# Altium project 0020-03_FFT2G.PrjPcb
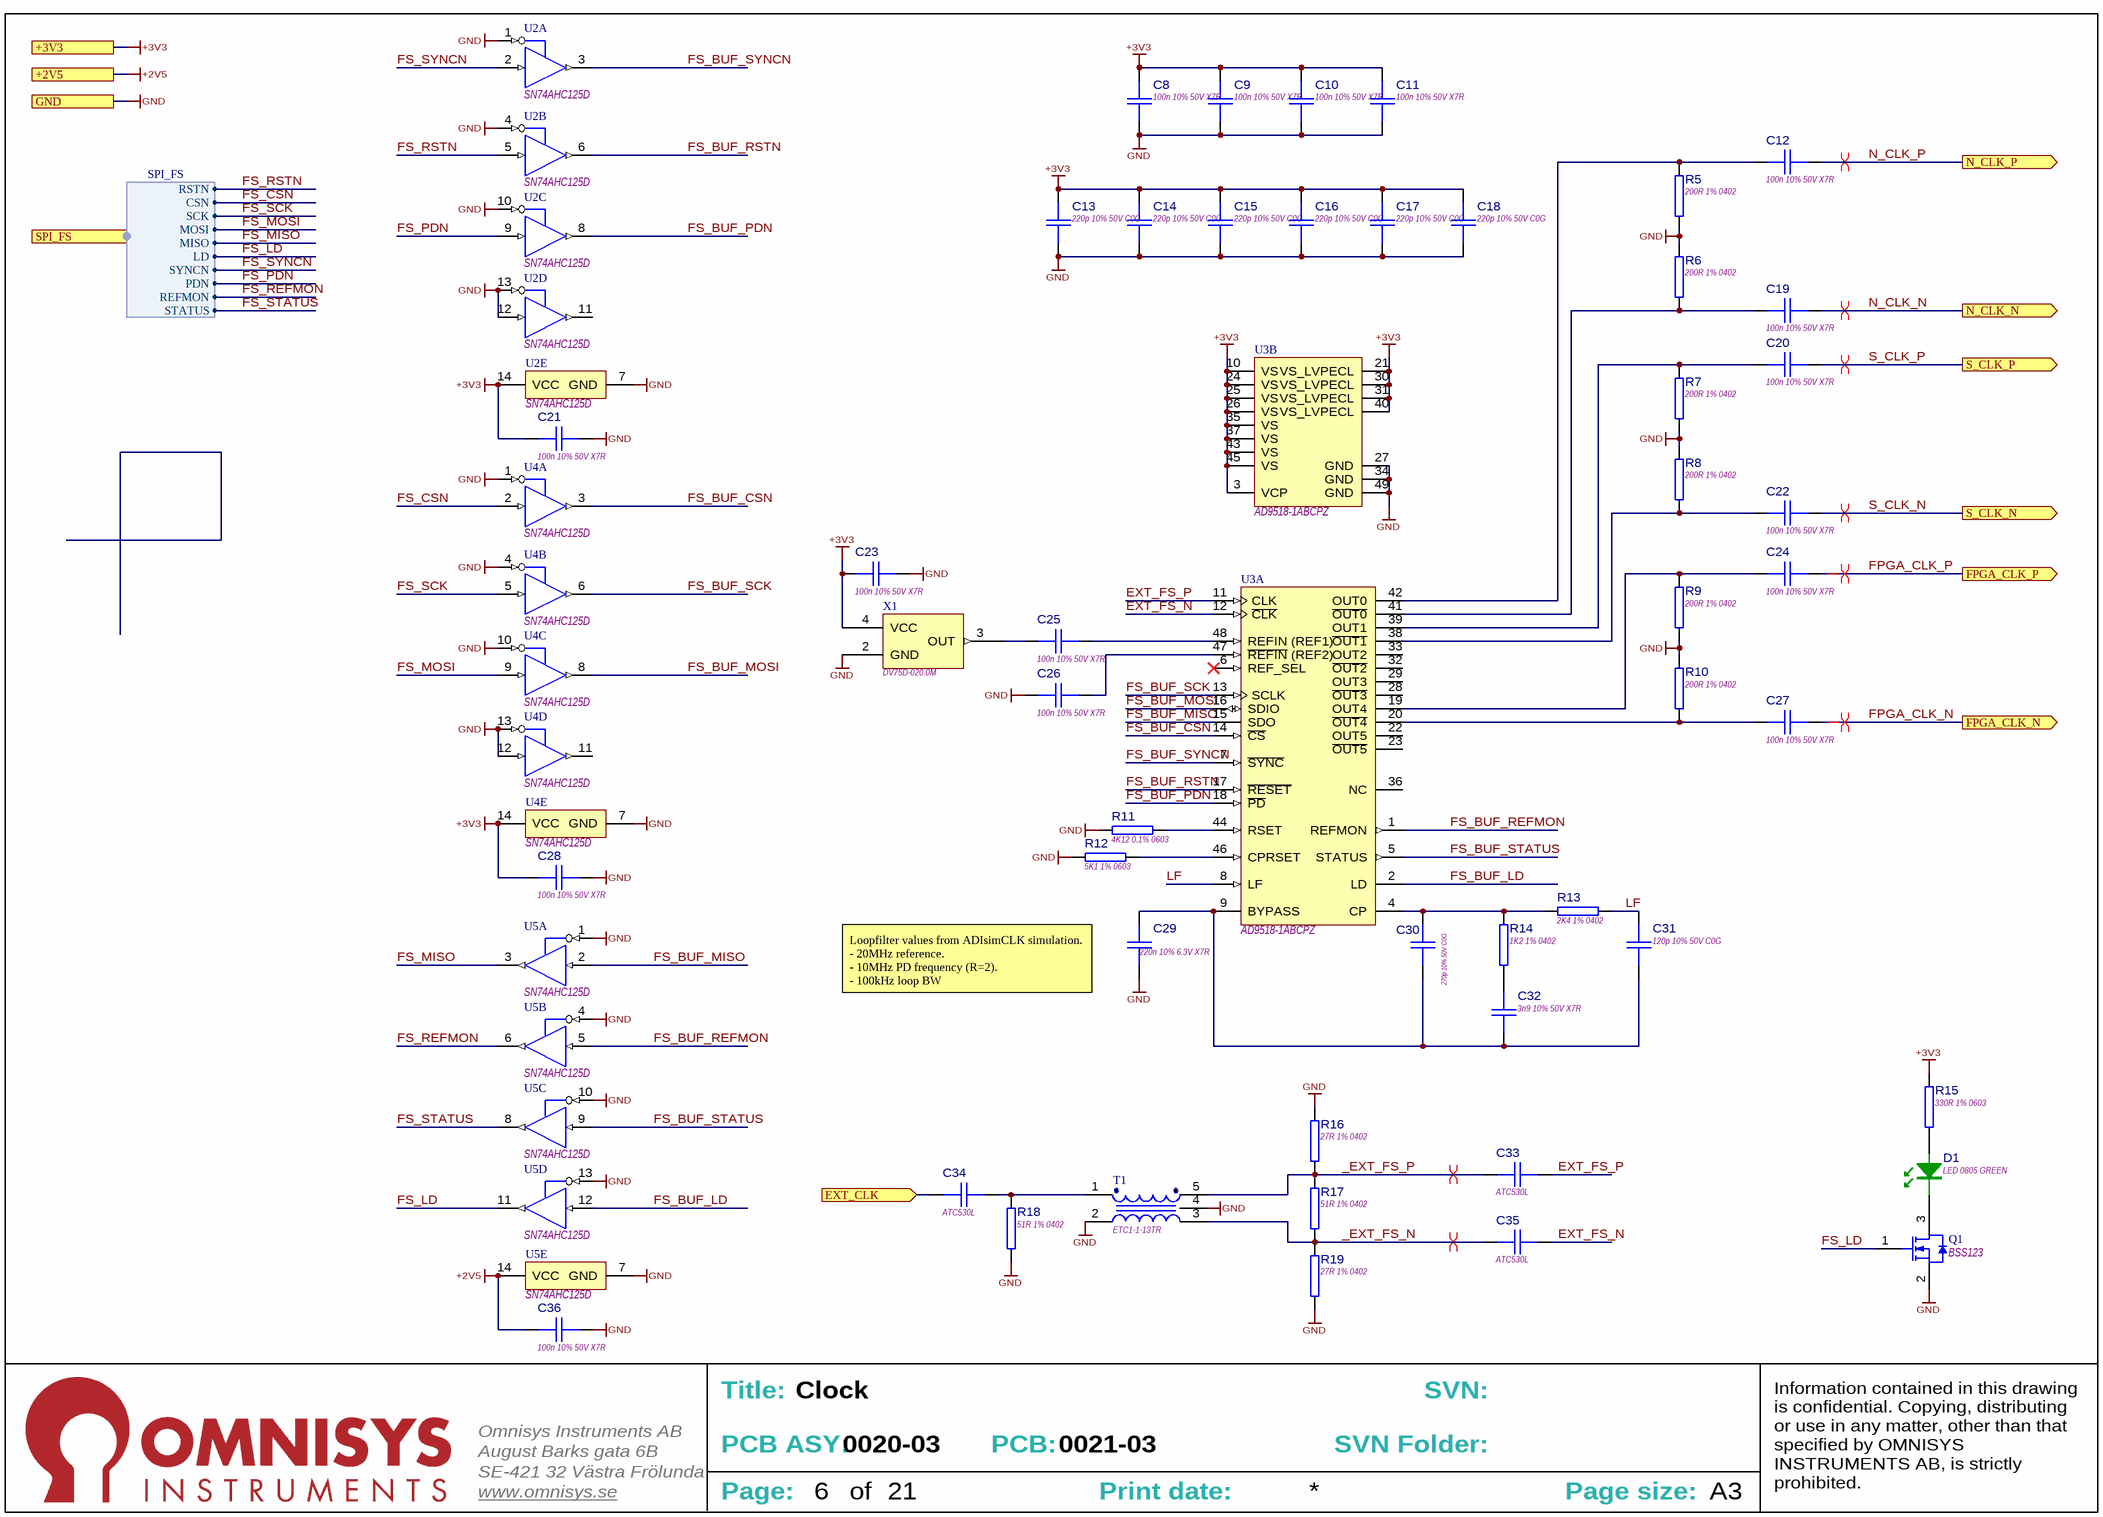
[diagram p0: [6] CLOCK.SchDoc]
PCB_Part: 0021-03; PCBASY_Part: 0020-03
1 sheet, 52 parts. Net scope: strictly hierarchical (ports join the sheet entries above them; power ports are local).
Board files: 0020-03_FFT2G.PcbDoc, PCB1.PcbDoc

## Sheet [6] CLOCK.SchDoc: Clock
size 393 x 281 mm; SheetNumber: 6; SheetTotal: 21; PageSetup: Record=PageOptions|CenterHorizontal=True|CenterVertical=True|PrintScale=0.94|XCorrection=0.00|YCorrection=0.00|PrintKind=0|BorderSize=5000000|LeftOffset=0|BottomOffset=0|Orientation=2|PaperLength=1000|PaperWidth=1000|Scale=100|PaperSource=15|PrintQuality=600|MediaType=1|DitherType=10|PrintScaleMode=1|PaperKind=A4; Adr1: August Barks gata 6B; Adr2: SE-421 32 Västra Frölunda; Adr3: Sweden; Webpage: www.omnisys.se

### Parts
C8  100n 10% 50V X7R  [CAPC1608X90N]
C9  100n 10% 50V X7R  [CAPC1608X90N]
C10  100n 10% 50V X7R  [CAPC1608X90N]
C11  100n 10% 50V X7R  [CAPC1608X90N]
C12  100n 10% 50V X7R  [CAPC1005X55L]
C13  220p 10% 50V C0G  [CAPC1005X55N]
C14  220p 10% 50V C0G  [CAPC1005X55N]
C15  220p 10% 50V C0G  [CAPC1005X55N]
C16  220p 10% 50V C0G  [CAPC1005X55N]
C17  220p 10% 50V C0G  [CAPC1005X55N]
C18  220p 10% 50V C0G  [CAPC1005X55N]
C19  100n 10% 50V X7R  [CAPC1005X55L]
C20  100n 10% 50V X7R  [CAPC1005X55L]
C21  100n 10% 50V X7R  [CAPC1608X90N]
C22  100n 10% 50V X7R  [CAPC1005X55L]
C23  100n 10% 50V X7R  [CAPC1608X90N]
C24  100n 10% 50V X7R  [CAPC1005X55L]
C25  100n 10% 50V X7R  [CAPC1005X55L]
C26  100n 10% 50V X7R  [CAPC1005X55L]
C27  100n 10% 50V X7R  [CAPC1005X55L]
C28  100n 10% 50V X7R  [CAPC1608X90N]
C29  220n 10% 6.3V X7R  [CAPC1608X90L]
C30  270p 10% 50V C0G  [CAPC1005X55L]
C31  120p 10% 50V C0G  [CAPC1005X55L]
C32  3n9 10% 50V X7R  [CAPC1005X55L]
C33  ATC530L  [CAPC1005X06L]
C34  ATC530L  [CAPC1005X06L]
C35  ATC530L  [CAPC1005X06L]
C36  100n 10% 50V X7R  [CAPC1608X90N]
D1  LED 0805 GREEN  [LED2012-GREEN]
Q1  BSS123  [SOT95P230X110-3N]
R5  200R 1% 0402  [RESC1005L]
R6  200R 1% 0402  [RESC1005L]
R7  200R 1% 0402  [RESC1005L]
R8  200R 1% 0402  [RESC1005L]
R9  200R 1% 0402  [RESC1005L]
R10  200R 1% 0402  [RESC1005L]
R11  4K12 0.1% 0603  [RESC1608N]
R12  5K1 1% 0603  [RESC1608N]
R13  2K4 1% 0402  [RESC1005L]
R14  1K2 1% 0402  [RESC1005L]
R15  330R 1% 0603  [RESC1608N]
R16  27R 1% 0402  [RESC1005L]
R17  51R 1% 0402  [RESC1005L]
R18  51R 1% 0402  [RESC1005L]
R19  27R 1% 0402  [RESC1005L]
T1  ETC1-1-13TR  [SOTFL50P160X73-3N]
U2  SN74AHC125D  [SOIC127P600X175-14N]  (parts A,B,C,D,E of 5)
U3  AD9518-1ABCPZ  [ADI-CP-48-8_M]  (parts A,B of 2)
U4  SN74AHC125D  [SOIC127P600X175-14N]  (parts A,B,C,D,E of 5)
U5  SN74AHC125D  [SOIC127P600X175-14N]  (parts A,B,C,D,E of 5)
X1  DV75D-020.0M  [DV75D]

### Ports
+2V5, +3V3, EXT_CLK (in), FPGA_CLK_N (out), FPGA_CLK_P (out), GND, N_CLK_N (out), N_CLK_P (out), S_CLK_N (out), S_CLK_P (out), SPI_FS (harness SPI_FS)

### Harnesses
SPI_FS: CSN, MOSI, SCK, MISO, RSTN, LD, SYNCN, PDN, REFMON, STATUS

### Nets
+2V5: C36.2 U5.14(VCC) ; port +2V5
+3V3: C8.2 C9.2 C10.2 C11.2 C13.2 C14.2 C15.2 C16.2 C17.2 C18.2 C21.2 C23.2 C28.2 R15.2 U2.14(VCC) U3.3(VCP) U3.10(VS) U3.21(VS_LVPECL) U3.24(VS) U3.25(VS) U3.26(VS) U3.30(VS_LVPECL) U3.31(VS_LVPECL) U3.35(VS) U3.37(VS) U3.40(VS_LVPECL) U3.43(VS) U3.45(VS) U4.14(VCC) X1.4(VCC) ; port +3V3
GND: C8.1 C9.1 C10.1 C11.1 C13.1 C14.1 C15.1 C16.1 C17.1 C18.1 C21.1 C23.1 C26.2 C28.1 C29.2 C36.1 Q1.2(S) R5.2 R6.2 R7.2 R8.2 R9.2 R10.2 R11.1 R12.1 R16.2 R18.2 R19.2 T1.2(Primary) T1.4(NC) U2.1(1OE#) U2.4(2OE#) U2.7(GND) U2.10(3OE#) U2.12(4A) U2.13(4OE#) U3.27(GND) U3.34(GND) U3.49(GND) U4.1(1OE#) U4.4(2OE#) U4.7(GND) U4.10(3OE#) U4.12(4A) U4.13(4OE#) U5.1(1OE#) U5.4(2OE#) U5.7(GND) U5.10(3OE#) U5.13(4OE#) X1.2(GND) ; port GND
_EXT_FS_N: C35.1 R17.1 R19.1 T1.3(Secondary)
_EXT_FS_P: C33.1 R16.1 R17.2 T1.5(Secondary_dot)
EXT_FS_N: C35.2 U3.12(~{CLK})
EXT_FS_P: C33.2 U3.11(CLK)
FPGA_CLK_N: C27.1 ; port FPGA_CLK_N
FPGA_CLK_P: C24.1 ; port FPGA_CLK_P
FS_BUF_CSN: U3.14(~{CS}) U4.3(1Y)
FS_BUF_LD: U3.2(LD) U5.12(4A)
FS_BUF_MISO: U3.15(SDO) U5.2(1A)
FS_BUF_MOSI: U3.16(SDIO) U4.8(3Y)
FS_BUF_PDN: U2.8(3Y) U3.18(~{PD})
FS_BUF_REFMON: U3.1(REFMON) U5.5(2A)
FS_BUF_RSTN: U2.6(2Y) U3.17(~{RESET})
FS_BUF_SCK: U3.13(SCLK) U4.6(2Y)
FS_BUF_STATUS: U3.5(STATUS) U5.9(3A)
FS_BUF_SYNCN: U2.3(1Y) U3.7(~{SYNC})
FS_CSN: U4.2(1A) ; port SPI_FS.CSN
FS_LD: Q1.1(G) U5.11(4Y) ; port SPI_FS.LD
FS_MISO: U5.3(1Y) ; port SPI_FS.MISO
FS_MOSI: U4.9(3A) ; port SPI_FS.MOSI
FS_PDN: U2.9(3A) ; port SPI_FS.PDN
FS_REFMON: U5.6(2Y) ; port SPI_FS.REFMON
FS_RSTN: U2.5(2A) ; port SPI_FS.RSTN
FS_SCK: U4.5(2A) ; port SPI_FS.SCK
FS_STATUS: U5.8(3Y) ; port SPI_FS.STATUS
FS_SYNCN: U2.2(1A) ; port SPI_FS.SYNCN
LF: C31.2 R13.2 U3.8(LF)
N_CLK_N: C19.1 ; port N_CLK_N
N_CLK_P: C12.1 ; port N_CLK_P
S_CLK_N: C22.1 ; port S_CLK_N
S_CLK_P: C20.1 ; port S_CLK_P
NetC12_2: C12.2 R5.1 U3.42(OUT0)
NetC19_2: C19.2 R6.1 U3.41(~{OUT0})
NetC20_2: C20.2 R7.1 U3.39(OUT1)
NetC22_2: C22.2 R8.1 U3.38(~{OUT1})
NetC24_2: C24.2 R9.1 U3.19(OUT4)
NetC25_1: C25.1 U3.48(REFIN_(REF1))
NetC25_2: C25.2 X1.3(OUT)
NetC26_1: C26.1 U3.47(~{REFIN}_(REF2))
NetC27_2: C27.2 R10.1 U3.20(~{OUT4})
NetC29_1: C29.1 C30.2 C31.1 C32.2 U3.9(BYPASS)
NetC30_1: C30.1 R13.1 R14.2 U3.4(CP)
NetC32_1: C32.1 R14.1
NetC34_1: C34.1 ; port EXT_CLK
NetC34_2: C34.2 R18.1 T1.1(Primary_dot)
NetD1_1: D1.1 Q1.3(D)
NetD1_2: D1.2 R15.1
NetR11_2: R11.2 U3.44(RSET)
NetR12_2: R12.2 U3.46(CPRSET)

Not connected (* = marked no-connect by the designer): U2 11(4Y); U3 6(REF_SEL)* 22(OUT5) 23(~{OUT5}) 28(~{OUT3}) 29(OUT3) 32(~{OUT2}) 33(OUT2) 36(NC); U4 11(4Y)

### Layout directives
differential pair; rule Differential Pairs Routing [Pref Gap = 0.2mm    Min Gap  = 0.2mm    Max Gap  = 0.2mmPref Width = 0.3mm    Min Width  = 0.2mm    Max Width  = 0.3mm]: N_CLK_N, N_CLK_P, S_CLK_N, S_CLK_P
differential pair: _EXT_FS_N, _EXT_FS_P
differential pair; rule Differential Pairs Routing [Pref Gap = 0.1mm    Min Gap  = 0.1mm    Max Gap  = 0.1mmPref Width = 0.1mm    Min Width  = 0.1mm    Max Width  = 0.1mm]; net class DiffPairs_FPGA_CLK: FPGA_CLK_N, FPGA_CLK_P

### Notes on the sheet
- Loopfilter values from ADIsimCLK simulation.
  - 20MHz reference.
  - 10MHz PD frequency (R=2).
  - 100kHz loop BW
- Title:
- SVN:
- August Barks gata 6B
- SE-421 32 Västra Frölunda
- Omnisys Instruments AB
- PCB ASY:
- PCB:
- SVN Folder:
- www.omnisys.se
- Page:
- of
- Print date:
- Page size:
- A3
- Information contained in this drawing is confidential. Copying, distributing or use in any matter, other than that specified by OMNISYS INSTRUMENTS AB, is strictly prohibited.

### Library data of the parts
C8-C11 C21 C23 C28 C36 = CMP-0300-002665-6: Ceramic Chip Capacitor, 0603/1608; Capacitance: 100nF; Package: 1608/0603; Temperature Charateristics: X7R; Tolerance: 10%; Rated Voltage: 50V; Thickness: 900µm; Weight: 9mg
C12 C19 C20 C22 C24-C27 = CMP-0300-002965-5: Ceramic Chip Capacitor, 0402/1005; Capacitance: 100nF; Package: 0402/1005; Temperature Charateristics: X7R; Tolerance: 10%; Thickness: 550µm; Rated Voltage: 50V
C13-C18 = CMP-0300-002795-5: Ceramic Chip Capacitor, 0402/1005; Capacitance: 220pF; Package: 0402/1005; Temperature Charateristics: C0G; Tolerance: 10%; Thickness: 550µm; Rated Voltage: 50V
C29 = CMP-0300-002106-6: Ceramic Chip Capacitor, 0603/1608; Capacitance: 220nF; Package: 1608/0603; Temperature Charateristics: X7R; Tolerance: 10%; Rated Voltage: 6.3V; Thickness: 900µm; Weight: 9mg
C30 = CMP-0300-002797-5: Ceramic Chip Capacitor, 0402/1005; Capacitance: 270pF; Package: 0402/1005; Temperature Charateristics: C0G; Tolerance: 10%; Thickness: 550µm; Rated Voltage: 50V
C31 = CMP-0300-002789-5: Ceramic Chip Capacitor, 0402/1005; Capacitance: 120pF; Package: 0402/1005; Temperature Charateristics: C0G; Tolerance: 10%; Thickness: 550µm; Rated Voltage: 50V
C32 = CMP-0300-002952-4: Ceramic Chip Capacitor, 0402/1005; Capacitance: 3.9nF; Package: 0402/1005; Temperature Charateristics: X7R; Tolerance: 10%; Thickness: 550µm; Rated Voltage: 50V
C33-C35 = CMP-0300-000000-2: 100n 16V ±15% 0402 (1005 metric) ATC530L104KT16T; Case-EIA: 0402; Case-Metric: 1005; Dielectric: X7R; OmnisysBuy: False; Maximum working voltage: 16V; Tolerance: ±15%; Technology: SMT
D1 = CMP-1500-000004-3
Q1 = CMP-1700-000042-1: MOSFET N-CH 100V 170MA SOT-23; Drain to Source Resistance: 6R; Element Configuration: Single; Fall Time: 9ns; Gate to Source Voltage (Vgs): 20V; Input Capacitance: 73pF; Max Power Dissipation: 360mW; Nominal Vgs: 1.7V; Number of Elements: 1; Turn-Off Delay Time: 17ns; Turn-On Delay Time: 1.7ns; Packaging: Tape and Reel; Case/Package: SOT-23; Contact Plating: Tin,Matte; Continuous Drain Current (ID): 170mA; Current Rating: 170mA; Drain to Source Breakdown Voltage: 100V; Drain to Source Voltage (Vdss): 100V; Dual Supply Voltage: 100V; Height: 0.93mm; Lead Free: Lead Free; Length: 2.92mm; Max Operating Temperature: 150°C; Min Operating Temperature: -55°C; Mount: Surface Mount; Number of Pins: 3; On-State Resistance: 6R; Package Quantity: 1; Power Dissipation: 360mW; Radiation Hardening: No; Rds On Max: 6R; REACH SVHC: No SVHC; Rise Time: 9ns; Threshold Voltage: 1.7V; Voltage: 100V; Voltage Rating (DC): 100V; Width: 1.3mm
R5-R10 = CMP-1800-001411-4: Thick film Chip Resistor, 0402/1005; Value: 200; Power: 100mW; Maximum working voltage: 50V; Temp. Coefficent: 0.01%; Tolerance: 1%; Case/Package: 0402/1005; Composition: Thick film
R11 = CMP-1800-002400-4: Thin film Chip Resistor, 0603/1608; Value: 4.12k; Maximum working voltage: 50V; Power: 100mW; Temp. Coefficent: 0.0015%; Tolerance: 0.1%; Case/Package: 0603/1608; Composition: Thin film
R12 = CMP-1800-002038-5: Thick film Chip Resistor, 0603/1608; Value: 5.1k; Power: 100mW; Maximum working voltage: 75V; Temp. Coefficent: 0.01%; Tolerance: 1%; Case/Package: 0603/1608; Composition: Thick film
R13 = CMP-1800-001437-4: Thick film Chip Resistor, 0402/1005; Value: 2.4k; Power: 100mW; Maximum working voltage: 50V; Temp. Coefficent: 0.01%; Tolerance: 1%; Case/Package: 0402/1005; Composition: Thick film
R14 = CMP-1800-001430-4: Thick film Chip Resistor, 0402/1005; Value: 1.2k; Power: 100mW; Maximum working voltage: 50V; Temp. Coefficent: 0.01%; Tolerance: 1%; Case/Package: 0402/1005; Composition: Thick film
R15 = CMP-1800-002010-5: Thick film Chip Resistor, 0603/1608; Value: 330; Power: 100mW; Maximum working voltage: 75V; Temp. Coefficent: 0.01%; Tolerance: 1%; Case/Package: 0603/1608; Composition: Thick film
R16 R19 = CMP-1800-001390-4: Thick film Chip Resistor, 0402/1005; Value: 27; Power: 100mW; Maximum working voltage: 50V; Temp. Coefficent: 0.01%; Tolerance: 1%; Case/Package: 0402/1005; Composition: Thick film
R17 R18 = CMP-1800-001397-4: Thick film Chip Resistor, 0402/1005; Value: 51; Power: 100mW; Maximum working voltage: 50V; Temp. Coefficent: 0.01%; Tolerance: 1%; Case/Package: 0402/1005; Composition: Thick film
T1 = CMP-2000-000004-1: Transformers Audio & Signal 4.5-3000MHz IL 2dB Impedance Ratio 1:1; Max DC Current: 30mA; Power Rating: 250mW; Case/Package: SMD/SMT; Package Quantity: 2000; Termination: SMD/SMT; Depth: 3.81mm; Max Operating Temperature: 85°C; Turns Ratio: 1:1; Length: 3.81mm; Width: 3.81mm; Radiation Hardening: No; Packaging: Tape and Reel; Min Operating Temperature: -40°C; Mount: Surface Mount; Number of Pins: 5; Height: 2.67mm; Lead Free: Contains Lead
U2 U4 U5 = CMP-2100-000562-3: Buffer/Line Driver 4-CH Non-Inverting 3-ST CMOS 14-Pin SOIC Tube; Number of Bits: 4; Min Supply Voltage: 2V; Propagation Delay: 15ns; High Level Output Current: -8mA; Quiescent Current: 4uA; Number of Bits per Element: 1; Max Supply Voltage: 5.5V; Logic Function: Buffer,Inverting; Turn-On Delay Time: 11.5ns; Low Level Output Current: 8mA; REACH SVHC: No SVHC; Max Operating Temperature: 125°C; Polarity: Non-Inverting; Case/Package: SOIC; Number of Elements: 4; Package Quantity: 50; Number of Output Lines: 4; Min Operating Temperature: -40°C; Length: 8.65mm; Mount: Surface Mount; Number of Channels: 4; Number of Pins: 14; Termination: SMD/SMT; Number of Inputs: 4; Radiation Hardening: No; Lead Free: Lead Free; Height: 1.58mm; Number of Input Lines: 4; Packaging: Rail/Tube; Width: 3.91mm; Number of Outputs: 4
U3 = CMP-2100-000590-1: IC CLOCK GEN 6CH 2.65GHZ 48LFCSP; Number of Circuits: 1; PLL: Yes; Input: CMOS; Number of Inputs: 2; Max Supply Voltage: 3.465V; Operating Supply Voltage: 3.3V; Max Supply Current: 100uA; Min Supply Voltage: 3.135V; Number of Outputs: 6; Height: 0.95mm; Min Operating Temperature: -40°C; Logic Function: Clock; Case/Package: LFCSP EP; Max Operating Temperature: 85°C; Packaging: Tray; Frequency: 2.65GHz; Width: 7.1mm; Number of Pins: 48; Radiation Hardening: No; REACH SVHC: No SVHC; Lead Free: Contains Lead; Max Frequency: 2.65GHz; Length: 7.1mm; Contact Plating: Tin,Matte
X1 = CMP-2400-000012-1: OSC TCXO 20.000MHZ LVCMOS SMD; Frequency Stability: 1ppm; Max Supply Current: 6mA; Frequency: 20MHz; Package Quantity: 250; Packaging: Tape and Reel; Case/Package: SMD/SMT; Max Operating Temperature: 85°C; Min Operating Temperature: -40°C

## Assembly variants
Design Variant: not fitted C72 C73 C74 C75 C76 C77 C78 C79 C80 C81 C82 C83 F3 F12 F13 J1 J2 J3 J4 J5 J6 J7 J8 J9 J12.1 J12.2 J12.3 J12.4 J13.1 J13.2 J13.3 J13.4 J14.1 J14.2 J14.3 J14.4 J15 J16.1 J16.2 J16.3 J16.4 J17 J18 J19 J20.1 J20.2 J20.3 J20.4 J21.1 J21.2 J21.3 J21.4 J22 J23 P1 P2 P3 P4 P5 P6 P7 P8 P9 P10 P11 P12 P13 P14 P15 P16 P17 P18 P19 P20 P21 P22 P23 P24 P25 P26 P27 P28 P29 PCB1 PCB2 R1 R2 R3 R31 R35 R38 R49 R50 R51 R52 R53 R54 R55 R56 R57 R84 R85 R86 R87 R88 R89 R90 R91 R130.1 R130.2 R130.3 R130.4 R131.1 R131.2 R131.3 R131.4 R138 R139 U13 X3; alternate parts C200.2 -> CMP-0300-002446-6, C201.2 -> CMP-0300-002453-6, R132.2 -> CMP-1800-002039-5, R132.1 -> CMP-1800-002412-4, C200.3 -> CMP-0300-002446-6, C201.3 -> CMP-0300-002453-6, R132.3 -> CMP-1800-002042-5, C200.4 -> CMP-0300-002445-6, C201.4 -> CMP-0300-002450-6, R132.4 -> CMP-1800-002047-5, C200.1 -> CMP-0300-002447-6, C201.1 -> CMP-0300-002454-6, R48.2 -> CMP-1800-002464-4, R48.3 -> CMP-1800-002469-4, R48.4 -> CMP-1800-002442-4, C199.4 -> CMP-0300-002107-6